# Altium schematic sheet PowerSupplies.SchDoc: =ProjectName
size 420 x 297 mm; Author: G.K.; CompanyName: WUT; DrawnBy: P.K.; Organization: WUT ISE; Address1: Warsaw Univeristy of Technology; Address2: Nowowiejska 15/19; DocumentNumber: 4; Revision: 1.0; SheetNumber: 4; SheetTotal: 12; EDA_Number: ARTIQ; Projet: ARTIQ/SINARA; ModifiedBy: -; CreateDate: XX/XX/XXXX; CheckedDate: -; Title2: PowerSupplies.SchDoc; DivGrp: ISE; Designer: P.K.; ModifiedDate: -; ProjectName: ARTIQ/SINARA
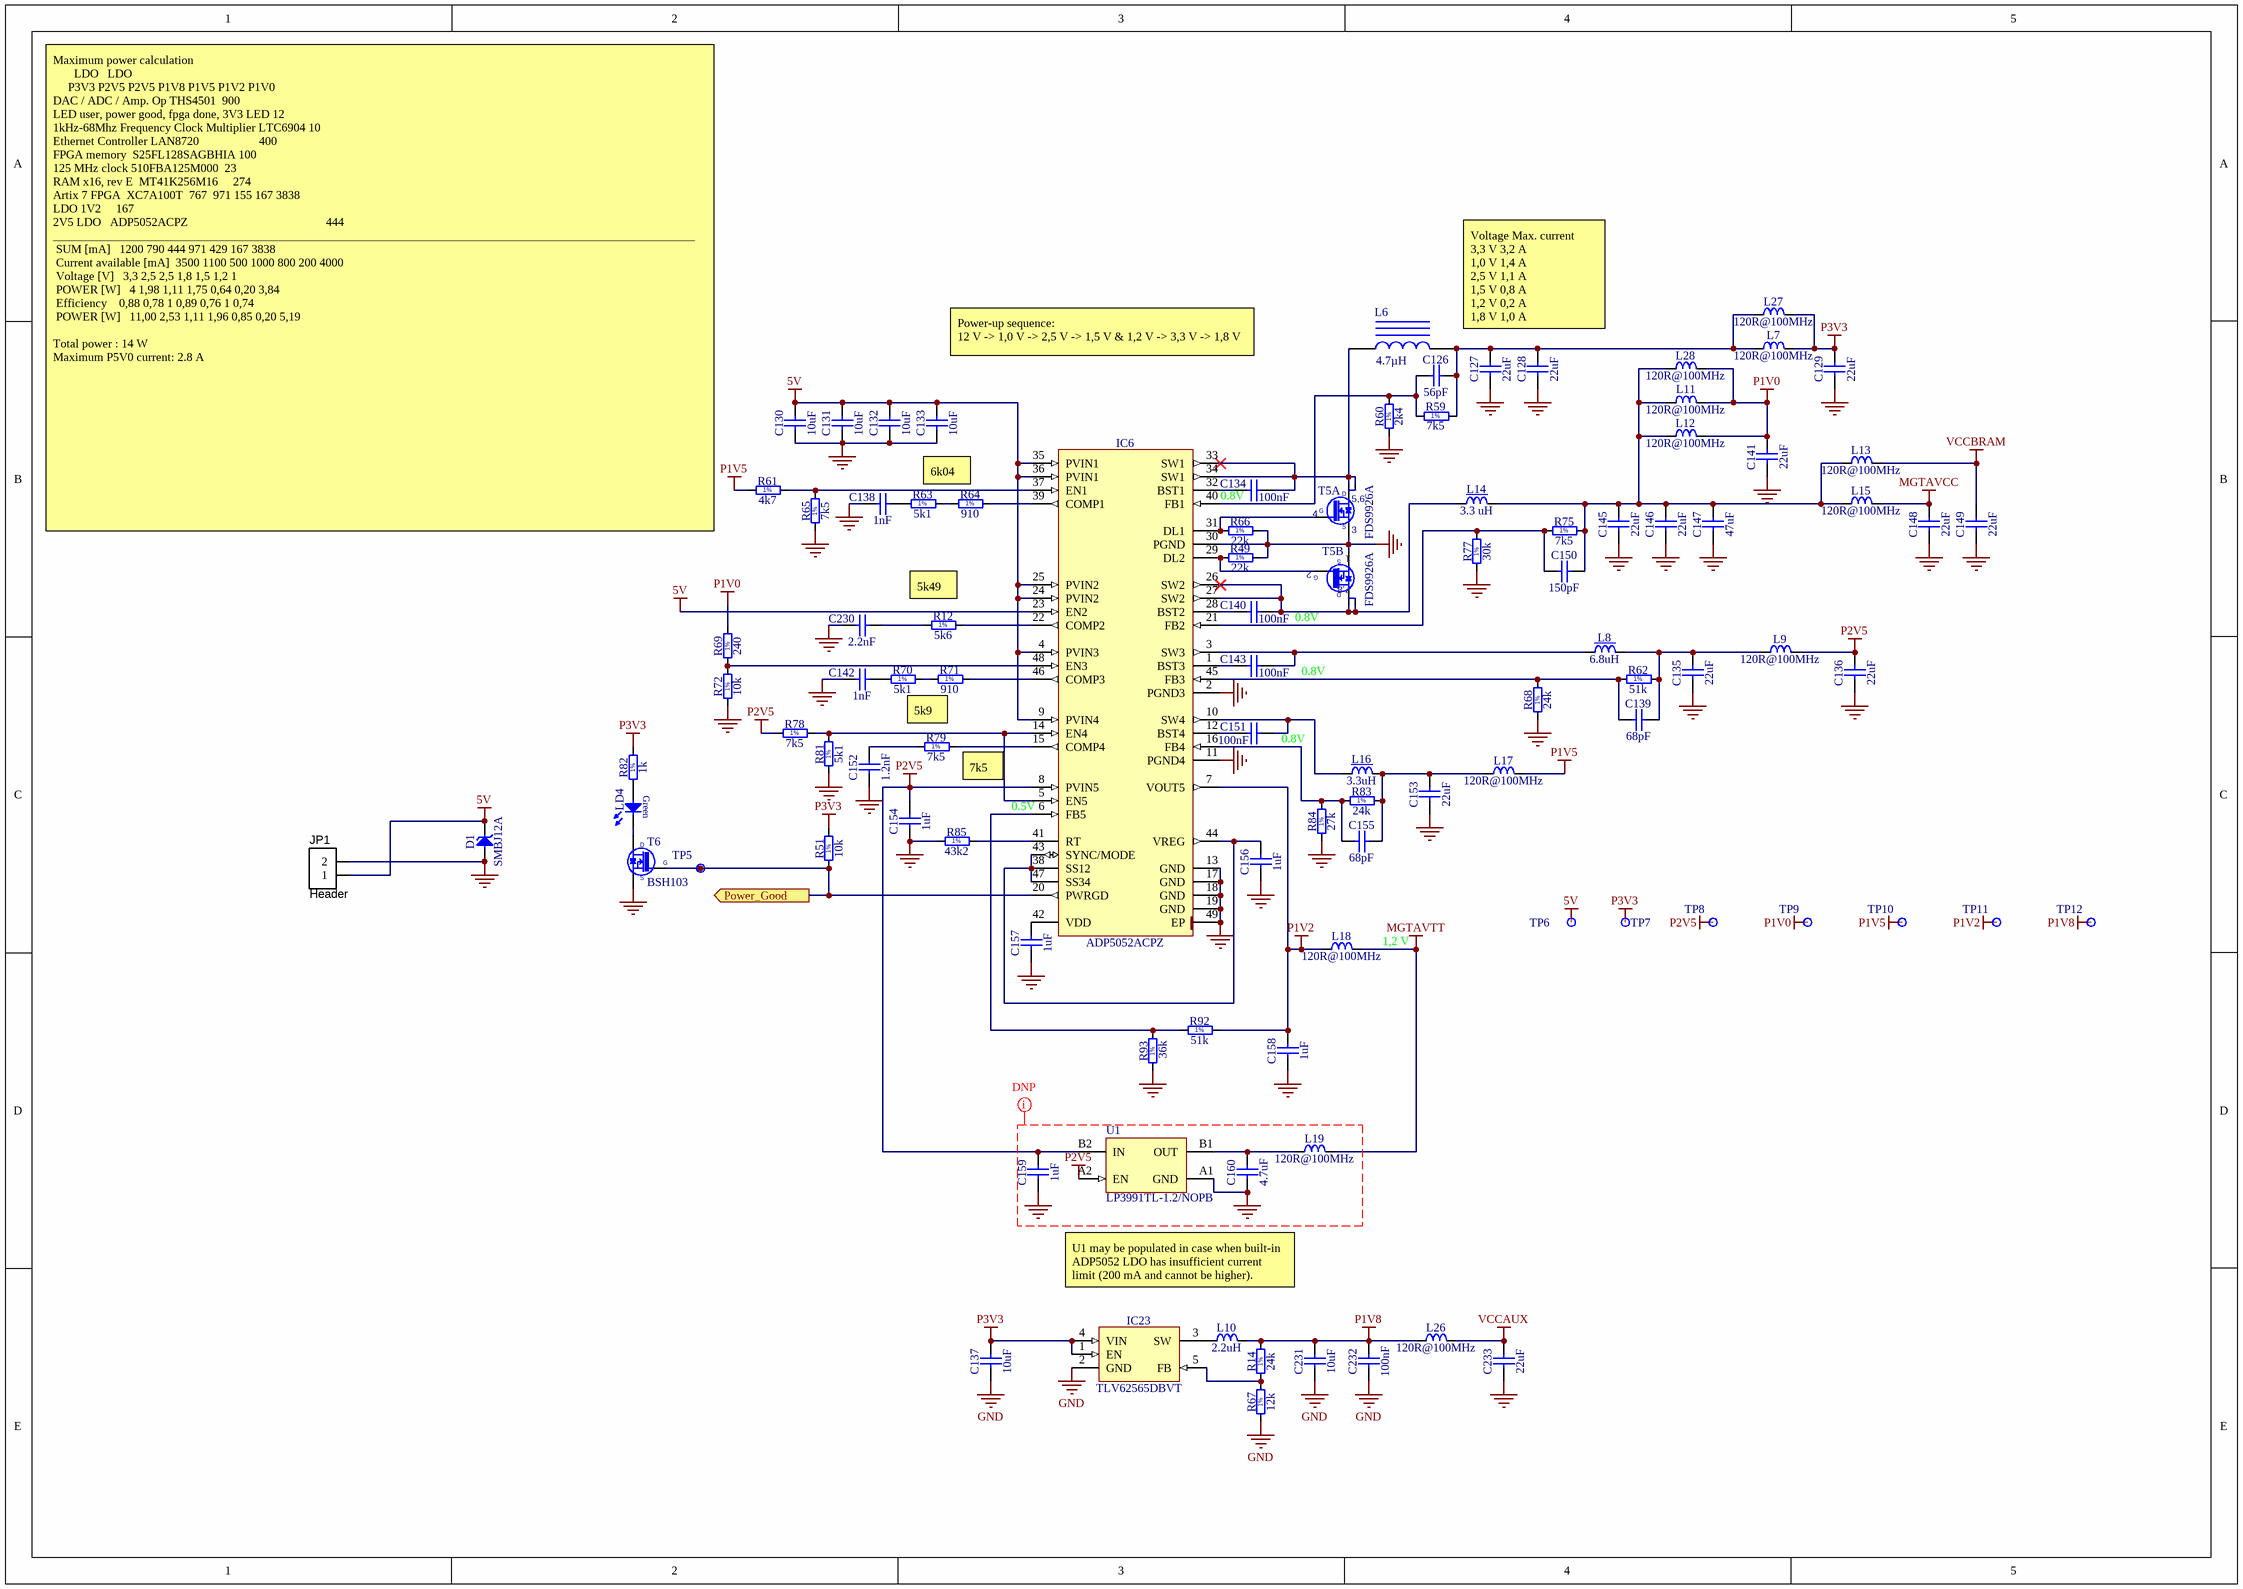
[diagram p0: PowerSupplies.SchDoc]

## Parts
C126  56pF  [CAPC1608X87N]
C127  22uF  [CAPC1709X100N]
C128  22uF  [CAPC1709X100N]
C129  22uF  [CAPC1709X100N]
C130  10uF  [CAPC2012X95N]
C131  10uF  [CAPC2012X95N]
C132  10uF  [CAPC2012X95N]
C133  10uF  [CAPC2012X95N]
C134  100nF  [CAPC0603X33N]
C135  22uF  [CAPC1709X100N]
C136  22uF  [CAPC1709X100N]
C137  10uF  [CAPC2012X95N]
C138  1nF  [CAPC1005X55N]
C139  68pF  [CAPC1005X55N]
C140  100nF  [CAPC0603X33N]
C141  22uF  [CAPC1709X100N]
C142  1nF  [CAPC1005X55N]
C143  100nF  [CAPC0603X33N]
C145  22uF  [CAPC1709X100N]
C146  22uF  [CAPC1709X100N]
C147  47uF  [CAPC3225X270N]
C148  22uF  [CAPC1709X100N]
C149  22uF  [CAPC1709X100N]
C150  150pF  [CAPC1005X55N]
C151  100nF  [CAPC0603X33N]
C152  1.2nF  [CAPC1608X87N]
C153  22uF  [CAPC1709X100N]
C154  1uF  [CAPC1005X55N]
C155  68pF  [CAPC1005X55N]
C156  1uF  [CAPC1005X55N]
C157  1uF  [CAPC1005X55N]
C158  1uF  [CAPC1005X55N]
C159  1uF  [CAPC1005X55N]
C160  4.7uF  [CAPC2012X135N]
C230  2.2nF  [CAPC1005X55N]
C231  10uF  [CAPC2012X95N]
C232  100nF  [CAPC0603X33N]
C233  22uF  [CAPC1709X100N]
D1  SMBJ12A  [SMB]
IC6  ADP5052ACPZ  [QFN50P700X700X80-49N-S570]
IC23  TLV62565DBVT  [SOT95P280X145-5N]
JP1  Header  [HDR_1x2_Offset]  (no BOM)
L6  Inductance: 4.7µH  [COBU-DR74-4R7-R_V]  (hidden comment: DR74-4R7-R)
L7  120R@100MHz  [INDC1608X65N]
L8  6.8uH  [IND_COILCRAFT_XAL4030]
L9  120R@100MHz  [INDC1608X65N]
L10  2.2uH  [IND_WURTH_WE-PMCI_0806LR]
L11  120R@100MHz  [INDC1608X65N]
L12  120R@100MHz  [INDC1608X65N]
L13  120R@100MHz  [INDC1608X65N]
L14  3.3 uH  [IHLP-2020BZ-11]
L15  120R@100MHz  [INDC1608X65N]
L16  3.3uH  [IND_WURTH_WE-PD3_S]
L17  120R@100MHz  [INDC1608X65N]
L18  120R@100MHz  [INDC1608X65N]
L19  120R@100MHz  [INDC1608X65N]
L26  120R@100MHz  [INDC1608X65N]
L27  120R@100MHz  [INDC1608X65N]
L28  120R@100MHz  [INDC1608X65N]
LD4  (no value)  [LED_KINGBRIGHT_KPH-1608CGCK]
R12  5k6  [RESC1005X40N]
R14  24k  [RESC1005X40N]
R49  22k  [RESC1005X40N]
R51  10k  [RESC1005X40N]
R59  7k5  [RESC1005X40N]
R60  2k4  [RESC1005X40N]
R61  4k7  [RESC1005X40N]
R62  51k  [RESC1005X40N]
R63  5k1  [RESC1005X40N]
R64  910  [RESC1005X40N]
R65  7k5  [RESC1005X40N]
R66  22k  [RESC1005X40N]
R67  12k  [RESC1005X40N]
R68  24k  [RESC1005X40N]
R69  240  [RESC1005X40N]
R70  5k1  [RESC1005X40N]
R71  910  [RESC1005X40N]
R72  10k  [RESC1005X40N]
R75  7k5  [RESC1005X40N]
R77  30k  [RESC1005X40N]
R78  7k5  [RESC1005X40N]
R79  7k5  [RESC1005X40N]
R81  5k1  [RESC1005X40N]
R82  1k  [RESC1005X40N]
R83  24k  [RESC1005X40N]
R84  27k  [RESC1005X40N]
R85  43k2  [RESC1005X35N]
R92  51k  [RESC1005X40N]
R93  36k  [RESC1005X40N]
T5  FDS9926A  [SOIC127P600X175-8N]  (parts A,B of 2)
T6  BSH103  [SOT23-3N]
TP5  Power Good  [TPS127]  (value not drawn)
TP6  P12V0  [TPS127]  (value not drawn)
TP7  P3V3  [TPS127]  (value not drawn)
TP8  P2V5  [TPS127]  (value not drawn)
TP9  P1V0  [TPS127]  (value not drawn)
TP10  P1V5  [TPS127]  (value not drawn)
TP11  P1V2  [TPS127]  (value not drawn)
TP12  P1V8  [TPS127]  (value not drawn)
U1  LP3991TL-1.2/NOPB  [YZR0004ABBA]

## Ports
Power_Good (out)

## Nets
5V: C130.2 C131.2 C132.2 C133.2 D1.1(C) IC6.4(PVIN3) IC6.9(PVIN4) IC6.23(EN2) IC6.24(PVIN2) IC6.25(PVIN2) IC6.35(PVIN1) IC6.36(PVIN1) JP1.1 TP6.1
GND: C127.1 C128.1 C129.1 C130.1 C131.1 C132.1 C133.1 C135.1 C136.1 C137.1 C138.1 C141.1 C142.1 C145.1 C146.1 C147.1 C148.1 C149.1 C152.1 C153.1 C154.1 C156.1 C157.1 C158.1 C159.1 C160.1 C230.1 C231.1 C232.1 C233.1 D1.2(A) IC6.2(PGND3) IC6.11(PGND4) IC6.13(GND) IC6.17(GND) IC6.18(GND) IC6.19(GND) IC6.30(PGND) IC6.49(EP) IC23.2(GND) JP1.2 R49.2 R60.1 R65.1 R66.2 R67.1 R68.1 R72.1 R77.1 R81.1 R84.1 R85.1 R93.1 T5.1(S) T5.3(S) T6.2(S) U1.A1(GND)
MGTAVCC: C148.2 L15.2
MGTAVTT: L18.2 L19.2
P1V0: C141.2 L11.2 L12.2 L28.2 R69.2 TP9.1
P1V2: C158.2 IC6.7(VOUT5) L18.1 R92.2 TP11.1
P1V5: L17.2 R61.1 TP10.1
P1V8: C231.2 C232.2 L10.2 L26.1 R14.2 TP12.1
P2V5: C136.2 C154.2 C159.2 IC6.8(PVIN5) L9.2 R78.1 TP8.1 U1.A2(EN) U1.B2(IN)
P3V3: C129.2 C137.2 IC23.1(EN) IC23.4(VIN) L7.2 L27.2 R51.2 R82.2 TP7.1
VCCAUX: C233.2 L26.2
VCCBRAM: C149.2 L13.2
Power_Good: IC6.20(PWRGD) R51.1 T6.1(G) TP5.1 ; port Power_Good
NetC126_1: C126.1 IC6.40(FB1) R59.1 R60.2
NetC126_2: C126.2 C127.2 C128.2 L6.2 L7.1 L27.1 R59.2
NetC134_1: C134.1 IC6.33(SW1) IC6.34(SW1) L6.1 T5.5(D) T5.6(D)
NetC134_2: C134.2 IC6.32(BST1)
NetC135_2: C135.2 C139.2 L8.2 L9.1 R62.2
NetC138_2: C138.2 R63.1
NetC139_1: C139.1 IC6.45(FB3) R62.1 R68.2
NetC140_1: C140.1 IC6.26(SW2) IC6.27(SW2) L14.1 T5.7(D) T5.8(D)
NetC140_2: C140.2 IC6.28(BST2)
NetC142_2: C142.2 R70.1
NetC143_1: C143.1 IC6.3(SW3) L8.1
NetC143_2: C143.2 IC6.1(BST3)
NetC145_2: C145.2 C146.2 C147.2 C150.2 L11.1 L12.1 L13.1 L14.2 L15.1 L28.1 R75.2
NetC150_1: C150.1 IC6.21(FB2) R75.1 R77.2
NetC151_1: C151.1 IC6.10(SW4) L16.1
NetC151_2: C151.2 IC6.12(BST4)
NetC152_2: C152.2 R79.1
NetC153_2: C153.2 C155.2 L16.2 L17.1 R83.2
NetC155_1: C155.1 IC6.16(FB4) R83.1 R84.2
NetC156_2: C156.2 IC6.38(SS12) IC6.43(SYNC/MODE) IC6.44(VREG) IC6.47(SS34)
NetC157_2: C157.2 IC6.42(VDD)
NetC160_2: C160.2 L19.1 U1.B1(OUT)
NetC230_2: C230.2 R12.1
NetIC6_5: IC6.5(EN5) IC6.14(EN4) R78.2 R81.2
NetIC6_6: IC6.6(FB5) R92.1 R93.2
NetIC6_15: IC6.15(COMP4) R79.2
NetIC6_22: IC6.22(COMP2) R12.2
NetIC6_29: IC6.29(DL2) R49.1 T5.2(G)
NetIC6_31: IC6.31(DL1) R66.1 T5.4(G)
NetIC6_37: IC6.37(EN1) R61.2 R65.2
NetIC6_39: IC6.39(COMP1) R64.2
NetIC6_41: IC6.41(RT) R85.2
NetIC6_46: IC6.46(COMP3) R71.2
NetIC6_48: IC6.48(EN3) R69.1 R72.2
NetIC23_3: IC23.3(SW) L10.1
NetIC23_5: IC23.5(FB) R14.1 R67.2
NetLD4_1: LD4.1(A) R82.1
NetLD4_2: LD4.2(C) T6.3(D)
NetR63_2: R63.2 R64.1
NetR70_2: R70.2 R71.1

## Layout directives
rule Undefined: GND, P2V5

## Notes on the sheet
- Voltage	Max. current
  3,3 V	3,2 A
  1,0 V	1,4 A
  2,5 V	1,1 A
  1,5 V	0,8 A
  1,2 V	0,2 A
  1,8 V	1,0 A
- Power-up sequence:
  12 V -> 1,0 V -> 2,5 V -> 1,5 V & 1,2 V -> 3,3 V -> 1,8 V
- (near R61) Maximum power calculation
  LDO			LDO
  P3V3	P2V5	P2V5	P1V8	P1V5	P1V2	P1V0
  DAC / ADC / Amp. Op THS4501		900
  LED user, power good, fpga done, 3V3 LED	12
  1kHz-68Mhz Frequency Clock Multiplier LTC6904	10
  Ethernet Controller	LAN8720		                  400
  FPGA memory		S25FL128SAGBHIA	100
  125 MHz clock	510FBA125M000		23
  RAM x16, rev E		MT41K256M16					274
  Artix 7 FPGA		XC7A100T		767		971	155	167	3838
  LDO 1V2					167
  2V5 LDO			ADP5052ACPZ                                              444
  ___________________________________________________________________________________________________________
  SUM [mA]			1200	790	444	971	429	167	3838
  Current available [mA]		3500	1100	500	1000	800	200	4000
  Voltage [V]			3,3	2,5	2,5	1,8	1,5	1,2	1
  POWER [W]			4	1,98	1,11	1,75	0,64	0,20	3,84
  Efficiency				0,88	0,78	1	0,89	0,76	1	0,74
  POWER [W]			11,00	2,53	1,11	1,96	0,85	0,20	5,19
  Total power : 14 W
  Maximum P5V0 current: 2.8 A
- 6k04
- (near C134) 0.8V
- (near R12) 5k49
- (near T5) 0.8V
- 5k9
- (near C143) 0.8V
- (near R79) 7k5
- (near C151) 0.8V
- (near IC6) 0.5V
- (near L18) 1,2 V
- U1 may be populated in case when built-in ADP5052 LDO has insufficient current limit (200 mA and cannot be higher).
- (in symbol 43k2 1% 0402) 1%
- (in symbol FDS9926A, part A) 5,6
- (in symbol FDS9926A, part B) 7,8
- (in symbol KINGBRIGHT_KPTR-3216CGCK) Green
- (in symbol R0402_1k_1%_0.0625W_100PPM) 1%
- (in symbol R0402_2K4_1%_0.0625W_100PPM) 1%
- (in symbol R0402_4K7_1%_0.0625W_100PPM) 1%
- (in symbol R0402_5K1_1%_0.0625W_100PPM) 1%
- (in symbol R0402_5K6_1%_0.0625W_100PPM) 1%
- (in symbol R0402_7K5_1%_0.0625W_100PPM) 1%
- (in symbol R0402_10K_1%_0.0625W_100PPM) 1%
- (in symbol R0402_12K_1%_0.0625W_100PPM) 1%
- (in symbol R0402_22K_1%_0.0625W_100PPM) 1%
- (in symbol R0402_24K_1%_0.0625W_100PPM) 1%
- (in symbol R0402_27K_1%_0.0625W_100PPM) 1%
- (in symbol R0402_30K_1%_0.0625W_100PPM) 1%
- (in symbol R0402_36K_1%_0.0625W_100PPM) 1%
- (in symbol R0402_51K_1%_0.0625W_100PPM) 1%
- (in symbol R0402_240R_1%_0.0625W_100PPM) 1%
- (in symbol R0402_910R_1%_0.0625W_100PPM) 1%

## Library data of the parts
C126 = CC0603_56PF_50V_5%_NP0: Non-polarised capacitor; Part Description: SMD Multilayer Chip Ceramic Capacitor; Manufacturer: GENERIC; Manufacturer1 Part Number: 223886715569; Voltage: 50V; TC: C0G/NP0; Tolerance: ±5%; Part Number: CC0603_56PF_50V_5%_NP0; Component Kind: Standard; Component Type: Standard; Pin Count: 2; Value: 56pF; Status: Preferred; Manufacturer Part Number: CC0603_56PF_50V_5%_NP0; Case: 0603; Mounted: Yes; Socket: No; SMD: Yes; Sense: No; Manufacturer1 Example: PHYCOMP; Manufacturer1 ComponentHeight: 0.87mm; HelpURL: \\cern.ch\dfs\Applications\Altium\Datasheets\CC0603_NP0_PHYCOMP.pdf; Author: CERN DEM JLC; CreateDate: 03.12.2007; LatestRevisionDate: 03.12.2007
C127-C129 C135 C136 C141 C145 C146 C148 C149 C153 C233 = CC0603_22UF_6.3V_20%_X5R: Non-polarised capacitor; Part Description: SMD Multilayer Chip Ceramic Capacitor; Manufacturer: GENERIC; Manufacturer1 Part Number: C1608X5R0J226M080AC; Voltage: 6.3V; TC: X5R; Tolerance: ±20%; Part Number: CC0603_22UF_6.3V_20%_X5R; Component Kind: Standard; Component Type: Standard; Pin Count: 2; Value: 22uF; Status: None; Manufacturer Part Number: CC0603_22UF_6.3V_20%_X5R; Case: 0603; Mounted: Yes; Socket: No; SMD: Yes; Sense: No; Manufacturer1 Example: TDK; Manufacturer1 ComponentHeight: 1mm; HelpURL: \\cern.ch\dfs\Applications\Altium\Datasheets\CC0603_X5R_TDK_C.pdf; Author: CERN DEM JLC; CreateDate: 16.12.2013; LatestRevisionDate: 13.09.2016
C130-C133 C137 C231 = CC0805_10UF_25V_10%_X5R: Non-polarised capacitor; Part Description: SMD Multilayer Chip Ceramic Capacitor; Manufacturer: GENERIC; Manufacturer1 Part Number: GRM219R61E106KA12D; Voltage: 25V; TC: X5R; Tolerance: ±10%; Part Number: CC0805_10UF_25V_10%_X5R; Component Kind: Standard; Component Type: Standard; Pin Count: 2; Value: 10uF; Status: Preferred; Manufacturer Part Number: CC0805_10UF_25V_10%_X5R; Case: 0805; Mounted: Yes; Socket: No; SMD: Yes; Sense: No; Manufacturer1 Example: MURATA; Manufacturer1 ComponentHeight: 0.95mm; HelpURL: \\cern.ch\dfs\Applications\Altium\Datasheets\CC0805_X5R_MURATA_GRM.pdf; Author: CERN DEM JLC
  C130-C133: CreateDate: 2012-10-25; LatestRevisionDate: 2016-09-06
  C137 C231: CreateDate: 25.10.2012; LatestRevisionDate: 06.09.2016
C134 C140 C143 C151 C232 = CC0201_100NF_6.3V_10%_X5R: Non-polarised capacitor; Part Description: SMD Multilayer Chip Ceramic Capacitor; Manufacturer: GENERIC; Manufacturer1 Part Number: 02016D104KAT2A; Voltage: 6.3V; TC: X5R; Tolerance: ±10%; Part Number: CC0201_100NF_6.3V_10%_X5R; Component Kind: Standard; Component Type: Standard; Pin Count: 2; Value: 100nF; Status: Not Recommended; Manufacturer Part Number: CC0201_100NF_6.3V_10%_X5R; Case: 0201; Mounted: Yes; Socket: No; SMD: Yes; Sense: No; Manufacturer1 Example: AVX; Manufacturer1 ComponentHeight: 0.33mm; HelpURL: \\cern.ch\dfs\Applications\Altium\Datasheets\CC0201_X5R_AVX.pdf; Author: CERN DEM JLC
  C134 C140 C143 C151: CreateDate: 2007-12-03; LatestRevisionDate: 2007-12-03
  C232: CreateDate: 03.12.2007; LatestRevisionDate: 03.12.2007
C138 C142 = CC0402_1NF_50V_10%_X7R: Non-polarised capacitor; Part Description: SMD Multilayer Chip Ceramic Capacitor; Manufacturer: GENERIC; Manufacturer1 Part Number: 223858715623; Voltage: 50V; TC: X7R; Tolerance: ±10%; Part Number: CC0402_1NF_50V_10%_X7R; Component Kind: Standard; Component Type: Standard; Pin Count: 2; Value: 1nF; Status: Not Recommended; Manufacturer Part Number: CC0402_1NF_50V_10%_X7R; Case: 0402; Mounted: Yes; Socket: No; SMD: Yes; Sense: No; Manufacturer1 Example: PHYCOMP; Manufacturer1 ComponentHeight: 0.55mm; HelpURL: \\cern.ch\dfs\Applications\Altium\Datasheets\CC0402_X7R_PHYCOMP.pdf; Author: CERN DEM JLC; CreateDate: 03.12.2007; LatestRevisionDate: 03.12.2007
C139 C155 = CC0402_68PF_50V_5%_C0G: Non-polarised capacitor; Part Description: SMD Multilayer Chip Ceramic Capacitor; Manufacturer: GENERIC; Manufacturer1 Part Number: C0402C680J5GACTU; Voltage: 50V; TC: C0G/NP0; Tolerance: ±5%; Part Number: CC0402_68PF_50V_5%_C0G; Component Kind: Standard; Component Type: Standard; Pin Count: 2; Value: 68pF; Status: Preferred; Manufacturer Part Number: CC0402_68PF_50V_5%_C0G; Case: 0402; Mounted: Yes; Socket: No; SMD: Yes; Sense: No; Manufacturer1 Example: KEMET; Manufacturer1 ComponentHeight: 0.55mm; HelpURL: \\cern.ch\dfs\Applications\Altium\Datasheets\CC0805_C0G_KEMET_(Commercial Grade).pdf; Author: CERN DEM JLC; CreateDate: 03.12.2007; LatestRevisionDate: 22.04.2015
C147 = CC1210_47UF_10V_10%_X7R: Non-polarised capacitor; Part Description: SMD Multilayer Chip Ceramic Capacitor; Manufacturer: GENERIC; Manufacturer1 Part Number: GRM32ER71A476KE15; Voltage: 10V; TC: X7R; Tolerance: ±10%; Part Number: CC1210_47UF_10V_10%_X7R; Component Kind: Standard; Component Type: Standard; Pin Count: 2; Value: 47uF; Status: None; Manufacturer Part Number: CC1210_47UF_10V_10%_X7R; Case: 1210; Mounted: Yes; Socket: No; SMD: Yes; Sense: No; Manufacturer1 Example: MURATA; Manufacturer1 ComponentHeight: 2.7mm; HelpURL: \\cern.ch\dfs\Applications\Altium\Datasheets\CC1210_X7R_MURATA.pdf; Author: CERN DEM BC; CreateDate: 18.11.2015; LatestRevisionDate: 18.11.2015
C150 = CC0402_150PF_50V_5%_C0G: Non-polarised capacitor; Part Description: SMD Multilayer Chip Ceramic Capacitor; Manufacturer: GENERIC; Manufacturer1 Part Number: C0402C151J5GACTU; Voltage: 50V; TC: C0G/NP0; Tolerance: ±5%; Part Number: CC0402_150PF_50V_5%_C0G; Component Kind: Standard; Component Type: Standard; Pin Count: 2; Value: 150pF; Status: Preferred; Manufacturer Part Number: CC0402_150PF_50V_5%_C0G; Case: 0402; Mounted: Yes; Socket: No; SMD: Yes; Sense: No; Manufacturer1 Example: KEMET; Manufacturer1 ComponentHeight: 0.55mm; HelpURL: \\cern.ch\dfs\Applications\Altium\Datasheets\CC0805_C0G_KEMET_(Commercial Grade).pdf; Author: CERN DEM JLC; CreateDate: 03.12.2007; LatestRevisionDate: 22.04.2015
C152 = CC0603_1.2NF_50V_10%_X7R: Non-polarised capacitor; Part Description: SMD Multilayer Chip Ceramic Capacitor; Manufacturer: GENERIC; Manufacturer1 Part Number: 223858615624; Voltage: 50V; TC: X7R; Tolerance: ±10%; Part Number: CC0603_1.2NF_50V_10%_X7R; Component Kind: Standard; Component Type: Standard; Pin Count: 2; Value: 1.2nF; Status: Preferred; Manufacturer Part Number: CC0603_1.2NF_50V_10%_X7R; Case: 0603; Mounted: Yes; Socket: No; SMD: Yes; Sense: No; Manufacturer1 Example: PHYCOMP; Manufacturer1 ComponentHeight: 0.87mm; HelpURL: \\cern.ch\dfs\Applications\Altium\Datasheets\CC0603_X7R_PHYCOMP.pdf; Author: CERN DEM JLC; CreateDate: 03.12.2007; LatestRevisionDate: 03.12.2007
C154 C156-C159 = CC0402_1UF_16V_10%_X5R: Non-polarised capacitor; Part Description: SMD Multilayer Chip Ceramic Capacitor; Manufacturer: GENERIC; Manufacturer1 Part Number: C1005X5R1C105KT; Voltage: 16V; TC: X5R; Tolerance: ±10%; Part Number: CC0402_1UF_16V_10%_X5R; Component Kind: Standard; Component Type: Standard; Pin Count: 2; Value: 1uF; Status: Preferred; Manufacturer Part Number: CC0402_1UF_16V_10%_X5R; Case: 0402; Mounted: Yes; Socket: No; SMD: Yes; Sense: No; Manufacturer1 Example: TDK; Manufacturer1 ComponentHeight: 0.55mm; HelpURL: \\cern.ch\dfs\Applications\Altium\Datasheets\CC0402_X5R_TDK_C.pdf; Author: CERN DEM JLC; CreateDate: 2012-10-25; LatestRevisionDate: 2012-10-25
C160 = CC0805_4.7UF_10V_10%_X5R: Non-polarised capacitor; Part Description: SMD Multilayer Chip Ceramic Capacitor; Manufacturer: GENERIC; Manufacturer1 Part Number: 222224013672; Voltage: 10V; TC: X5R; Tolerance: ±10%; Part Number: CC0805_4.7UF_10V_10%_X5R; Component Kind: Standard; Component Type: Standard; Pin Count: 2; Value: 4.7uF; Status: Preferred; Manufacturer Part Number: CC0805_4.7UF_10V_10%_X5R; Case: 0805; Mounted: Yes; Socket: No; SMD: Yes; Sense: No; Manufacturer1 Example: PHYCOMP; Manufacturer1 ComponentHeight: 1.45mm; HelpURL: \\cern.ch\dfs\Applications\Altium\Datasheets\CC0805_X5R_PHYCOMP_HC.pdf; Author: CERN DEM JLC; CreateDate: 03.12.2007; LatestRevisionDate: 03.12.2007
C230 = CC0402_2.2NF_50V_10%_X7R: Non-polarised capacitor; Part Description: SMD Multilayer Chip Ceramic Capacitor; Manufacturer: GENERIC; Manufacturer1 Part Number: 223858715627; Voltage: 50V; TC: X7R; Tolerance: ±10%; Part Number: CC0402_2.2NF_50V_10%_X7R; Component Kind: Standard; Component Type: Standard; Pin Count: 2; Value: 2.2nF; Status: Not Recommended; Manufacturer Part Number: CC0402_2.2NF_50V_10%_X7R; Case: 0402; Mounted: Yes; Socket: No; SMD: Yes; Sense: No; Manufacturer1 Example: PHYCOMP; Manufacturer1 ComponentHeight: 0.55mm; HelpURL: \\cern.ch\dfs\Applications\Altium\Datasheets\CC0402_X7R_PHYCOMP.pdf; Author: CERN DEM JLC; CreateDate: 03.12.2007; LatestRevisionDate: 03.12.2007
D1 = SMBJ12A: Zener Diode; Part Description: Uni-Directional Transient Voltage Suppressor Diode; Manufacturer: FAIRCHILD SEMICONDUCTOR; Voltage: 12V; Power: 600W; PressFit: No; Bonding: No; Part Number: SMBJ12A; Component Kind: Standard; Component Type: Standard; Device: SMBJ12A; Footprint: DIOM5336X265N; PackageDescription: DO-214-AA/SMB Diode, Molded Body; 5.34mm L X 3.625mm W X 2.65mm H, IPC Medium Density; Manufacturer Part Number: SMBJ12A; Pin Count: 2; Case: DO-214AA; Mounted: Yes; Socket: No; SMD: Yes; Sense: No; ComponentHeight: 2.65mm; HelpURL: \\cern.ch\dfs\Applications\Altium\Datasheets\SMBJ.pdf; Author: CERN DEM JLC; CreateDate: 10.04.2013; LatestRevisionDate: 10.04.2013
IC6 = ADP5052ACPZ: 5-Channel Integrated Power Solution with Quad buck Regulators and 200mA LDO Regulator; Manufacturer: ANALOG DEVICES; PressFit: No; Bonding: No; Part Number: ADP5052ACPZ; Component Kind: Standard; Component Type: Standard; Device: ADP5052ACPZ; PackageDescription: QFN, 0.50mm pitch,square; 12 pin X 12 pin, 7mm X 7mm X 0.8mm H body (w/thermal tab 5.70 X 5.70mm),  IPC Medium Density; Part Description: 5-Channel Integrated Power Solution with Quad buck Regulators and 200mA LDO Regulator; Manufacturer Part Number: ADP5052ACPZ; Pin Count: 49; Case: QFN48; Mounted: Yes; Socket: No; SMD: Yes; Sense: No; ComponentHeight: 0.8mm; HelpURL: \\cern.ch\dfs\Applications\Altium\Datasheets\ADP5052ACPZ.pdf; Author: CERN DEM BC; CreateDate: 2015-07-30; LatestRevisionDate: 2015-07-30
IC23 = TLV62565DBVT: 1.5A High Efficiency Step-Down Converter, Adjustable Output Voltage; Manufacturer: TEXAS INSTRUMENTS; PressFit: No; Bonding: No; Part Number: TLV62565DBVT; Component Kind: Standard; Component Type: Standard; Device: TLV62565DBVT; PackageDescription: SOT, 0.95mm Pitch; 5 Pin, 1.60mm W X 2.90mm L X 1.45mm H Body, IPC Medium Density; Part Description: 1.5A High Efficiency Step-Down Converter, Adjustable Output Voltage; Manufacturer Part Number: TLV62565DBVT; Pin Count: 5; Case: SOT23-5; Mounted: Yes; Socket: No; SMD: Yes; Sense: No; ComponentHeight: 1.45mm; HelpURL: \\cern.ch\dfs\Applications\Altium\Datasheets\TLV62565DBVT.pdf; Author: CERN DEM JMW; CreateDate: 29.08.2016; LatestRevisionDate: 29.08.2016
JP1 = Header2P: 12V  G
L6 = CMP-2000-06180-1: High Power Density, High Efficiency, Shielded Inductor, 4.7 uH, -40 to 125 degC, RoHS, Tape and Reel; Manufacturer: Eaton; Tolerance: ±20%; Current - Saturation: 4.37A; Type: Wirewound; Frequency - Test: 100kHz; Current Rating: 3.34A; DC Resistance (DCR): 25.4mOhm; Material - Core: Ferrite; Package Reference: DR74-4R7-R; Ratings: -; Frequency - Self Resonant: -; Operating Temperature: -40°C~125°C; Family: FixedInductors; Package / Case: Nonstandard; Mounting Type: SurfaceMount; Series: DR; Q @ Freq: -; Datasheet Version: 12/2012; Package Description: 2-Pin Surface Mount Device, Body 7.6 x 7.6 mm; Height - Seated (Max): 0.171"(4.35mm); Datasheet URL: https://datasheet.ciiva.com/14667/0900766b8116a153-14667792.pdf; Packaging: Tape&amp;Reel(TR); Manufacturer URL: http://www.cooperindustries.com/content/public/en/bussmann/electronics.html; Mounting Technology: SurfaceMount; Size / Dimension: 0.299"Lx0.299"W(7.60mmx7.60mm); Category: Inductors,Coils,Chokes; Shielding: Shielded
L7 L9 L11-L13 L15 L17-L19 L26-L28 = IND0603_MURATA_BLM18SG121TN1D: Inductor; Part Description: SMD EMIFIL Suppression Chip Ferrite Bead; Manufacturer: MURATA; Power: 3A; Resistance: 0.025R; Tolerance: ±25%; Part Number: IND0603_MURATA_BLM18SG121TN1D; Component Kind: Standard; Component Type: Standard; Pin Count: 2; Value: 120R@100MHz; Status: None; Manufacturer Part Number: BLM18SG121TN1D; Case: 0603; Mounted: Yes; Socket: No; SMD: Yes; Sense: No; ComponentHeight: 0.65mm; HelpURL: \\cern.ch\dfs\Applications\Altium\Datasheets\IND0603_MURATA_BLM18S.pdf; Author: CERN DEM JLC; CreateDate: 23.07.2014; LatestRevisionDate: 23.07.2014
L8 = IND_6.8UH_20%_COILCRAFT_XAL4030: Inductor With Core; Part Description: SMD Shielded Power Inductor; Manufacturer Part Number: XAL4030-682MEB; Power: 3A; Resistance: 0.0741R; Tolerance: ±20%; Part Number: IND_6.8UH_20%_COILCRAFT_XAL4030; Component Kind: Standard; Component Type: Standard; Pin Count: 2; Value: 6.8uH; Status: None; Manufacturer: COILCRAFT; Mounted: Yes; Socket: No; SMD: Yes; Sense: No; ComponentHeight: 2.1mm; HelpURL: \\cern.ch\dfs\Applications\Altium\Datasheets\IND_COILCRAFT_XAL4030.pdf; Author: CERN DEM MR; CreateDate: 14.03.2016; LatestRevisionDate: 14.03.2016
L10 = IND_2.2UH_20%_WURTH_WE-PMCI_74479276222C: Inductor; Part Description: SMD Power Molded Chip  Inductor (WE-PMCI Series); Manufacturer: WURTH ELEKTRONIK; Power: 1.1A; Resistance: 0.112R; Tolerance: ±20%; Part Number: IND_2.2UH_20%_WURTH_WE-PMCI_74479276222C; Component Kind: Standard; Component Type: Standard; Pin Count: 2; Value: 2.2uH; Status: None; Manufacturer Part Number: 74479276222C; Case: 0806; Mounted: Yes; Socket: No; SMD: Yes; Sense: No; ComponentHeight: 1mm; HelpURL: \\cern.ch\dfs\Applications\Altium\Datasheets\IND_WURTH_WE-PMCI_74479276222C.pdf; Author: CERN DEM JLC; CreateDate: 20.10.2016; LatestRevisionDate: 20.10.2016
L14 = IHLP2020BZER3R3M11: Inductor With Core; Manufacturer: Vishay; Power: 4.1 A; Series Resistance: 57.8 mOhm; Tolerance: 20%; Value: 3.3 uH; HelpURL: http://datasheet.octopart.com/IHLP2020BZER3R3M11-Vishay-datasheet-68298978.pdf; Part Number: IHLP2020BZER3R3M11; Supplier 1: Farnell
L16 = IND_3.3UH_20%_WURTH_WE-PD3_74451033: Inductor With Core; Part Description: Shielded Power Inductor (WE-PD 3 Series); Manufacturer: WURTH ELEKTRONIK; Power: 1.6A; Resistance: 0.025R; Tolerance: ±20%; Part Number: IND_3.3UH_20%_WURTH_WE-PD3_74451033; Component Kind: Standard; Component Type: Standard; Pin Count: 2; Value: 3.3uH; Status: None; Manufacturer Part Number: 74451033; Mounted: Yes; Socket: No; SMD: Yes; Sense: No; ComponentHeight: 2.92mm; HelpURL: \\cern.ch\dfs\Applications\Altium\Datasheets\IND_WURTH_WE-PD3_74451033.pdf; Author: CERN DEM JLC; CreateDate: 11.05.2010; LatestRevisionDate: 15.09.2014
LD4 = KINGBRIGHT_KPTR-3216CGCK: LED Green 1A 2C; Manufacturer Part Number: KPH-1608CGCK; ComponentHeight: 0.65mm; HelpURL: http://datasheet.octopart.com/KPH-1608CGCK-Kingbright-datasheet-62316526.pdf; Package Description: SMT Green LED, Case 0603, Body L 1.6 x W 0.8mm H 0.65mm
R12 = R0402_5K6_1%_0.0625W_100PPM: Resistor - 1%; Part Description: General Purpose Thick Film Chip Resistor; Manufacturer: GENERIC; Manufacturer1 Part Number: 232270675602L; TC: ±100ppm/°C; PressFit: No; Part Number: R0402_5K6_1%_0.0625W_100PPM; Component Kind: Standard; Component Type: Standard; Pin Count: 2; Value: 5k6; Status: Not Recommended; Power: 0.0625W; Tolerance: ±1%; Manufacturer Part Number: R0402_5K6_1%_0.0625W_100PPM; Case: 0402; Mounted: Yes; Sense: No; Socket: No; SMD: Yes; Manufacturer1 Example: YAGEO PHYCOMP; Manufacturer1 ComponentHeight: 0.4mm; HelpURL: \\cern.ch\dfs\Applications\Altium\Datasheets\R0402_Phycomp_RC0402.pdf; Author: CERN DEM JLC; CreateDate: 03.12.2007; LatestRevisionDate: 17.10.2012
R14 R68 R83 = R0402_24K_1%_0.0625W_100PPM: Resistor - 1%; Part Description: General Purpose Thick Film Chip Resistor; Manufacturer: GENERIC; Manufacturer1 Part Number: 232270672403L; TC: ±100ppm/°C; PressFit: No; Part Number: R0402_24K_1%_0.0625W_100PPM; Component Kind: Standard; Component Type: Standard; Pin Count: 2; Value: 24k; Status: Not Recommended; Power: 0.0625W; Tolerance: ±1%; Manufacturer Part Number: R0402_24K_1%_0.0625W_100PPM; Case: 0402; Mounted: Yes; Sense: No; Socket: No; SMD: Yes; Manufacturer1 Example: YAGEO PHYCOMP; Manufacturer1 ComponentHeight: 0.4mm; HelpURL: \\cern.ch\dfs\Applications\Altium\Datasheets\R0402_Phycomp_RC0402.pdf; Author: CERN DEM JLC; CreateDate: 03.12.2007; LatestRevisionDate: 17.10.2012
R49 R66 = R0402_22K_1%_0.0625W_100PPM: Resistor - 1%; Part Description: General Purpose Thick Film Chip Resistor; Manufacturer: GENERIC; Manufacturer1 Part Number: 232270672203L; TC: ±100ppm/°C; PressFit: No; Part Number: R0402_22K_1%_0.0625W_100PPM; Component Kind: Standard; Component Type: Standard; Pin Count: 2; Value: 22k; Status: Not Recommended; Power: 0.0625W; Tolerance: ±1%; Manufacturer Part Number: R0402_22K_1%_0.0625W_100PPM; Case: 0402; Mounted: Yes; Sense: No; Socket: No; SMD: Yes; Manufacturer1 Example: YAGEO PHYCOMP; Manufacturer1 ComponentHeight: 0.4mm; HelpURL: \\cern.ch\dfs\Applications\Altium\Datasheets\R0402_Phycomp_RC0402.pdf; Author: CERN DEM JLC; CreateDate: 03.12.2007; LatestRevisionDate: 17.10.2012
R51 R72 = R0402_10K_1%_0.0625W_100PPM: Resistor - 1%; Part Description: General Purpose Thick Film Chip Resistor; Manufacturer: GENERIC; Manufacturer1 Part Number: 232270671003L; TC: ±100ppm/°C; PressFit: No; Part Number: R0402_10K_1%_0.0625W_100PPM; Component Kind: Standard; Component Type: Standard; Pin Count: 2; Value: 10k; Status: Not Recommended; Power: 0.0625W; Tolerance: ±1%; Manufacturer Part Number: R0402_10K_1%_0.0625W_100PPM; Case: 0402; Mounted: Yes; Sense: No; Socket: No; SMD: Yes; Manufacturer1 Example: YAGEO PHYCOMP; Manufacturer1 ComponentHeight: 0.4mm; HelpURL: \\cern.ch\dfs\Applications\Altium\Datasheets\R0402_Phycomp_RC0402.pdf; Author: CERN DEM JLC; CreateDate: 03.12.2007; LatestRevisionDate: 17.10.2012
R59 R65 R75 R78 R79 = R0402_7K5_1%_0.0625W_100PPM: Resistor - 1%; Part Description: General Purpose Thick Film Chip Resistor; Manufacturer: GENERIC; Manufacturer1 Part Number: 232270677502L; TC: ±100ppm/°C; PressFit: No; Part Number: R0402_7K5_1%_0.0625W_100PPM; Component Kind: Standard; Component Type: Standard; Pin Count: 2; Value: 7k5; Status: Not Recommended; Power: 0.0625W; Tolerance: ±1%; Manufacturer Part Number: R0402_7K5_1%_0.0625W_100PPM; Case: 0402; Mounted: Yes; Sense: No; Socket: No; SMD: Yes; Manufacturer1 Example: YAGEO PHYCOMP; Manufacturer1 ComponentHeight: 0.4mm; HelpURL: \\cern.ch\dfs\Applications\Altium\Datasheets\R0402_Phycomp_RC0402.pdf; Author: CERN DEM JLC; CreateDate: 03.12.2007; LatestRevisionDate: 17.10.2012
R60 = R0402_2K4_1%_0.0625W_100PPM: Resistor - 1%; Part Description: General Purpose Thick Film Chip Resistor; Manufacturer: GENERIC; Manufacturer1 Part Number: 232270672402L; TC: ±100ppm/°C; PressFit: No; Part Number: R0402_2K4_1%_0.0625W_100PPM; Component Kind: Standard; Component Type: Standard; Pin Count: 2; Value: 2k4; Status: Not Recommended; Power: 0.0625W; Tolerance: ±1%; Manufacturer Part Number: R0402_2K4_1%_0.0625W_100PPM; Case: 0402; Mounted: Yes; Sense: No; Socket: No; SMD: Yes; Manufacturer1 Example: YAGEO PHYCOMP; Manufacturer1 ComponentHeight: 0.4mm; HelpURL: \\cern.ch\dfs\Applications\Altium\Datasheets\R0402_Phycomp_RC0402.pdf; Author: CERN DEM JLC; CreateDate: 03.12.2007; LatestRevisionDate: 17.10.2012
R61 = R0402_4K7_1%_0.0625W_100PPM: Resistor - 1%; Part Description: General Purpose Thick Film Chip Resistor; Manufacturer: GENERIC; Manufacturer1 Part Number: 232270674702L; TC: ±100ppm/°C; PressFit: No; Part Number: R0402_4K7_1%_0.0625W_100PPM; Component Kind: Standard; Component Type: Standard; Pin Count: 2; Value: 4k7; Status: Not Recommended; Power: 0.0625W; Tolerance: ±1%; Manufacturer Part Number: R0402_4K7_1%_0.0625W_100PPM; Case: 0402; Mounted: Yes; Sense: No; Socket: No; SMD: Yes; Manufacturer1 Example: YAGEO PHYCOMP; Manufacturer1 ComponentHeight: 0.4mm; HelpURL: \\cern.ch\dfs\Applications\Altium\Datasheets\R0402_Phycomp_RC0402.pdf; Author: CERN DEM JLC; CreateDate: 03.12.2007; LatestRevisionDate: 17.10.2012
R62 R92 = R0402_51K_1%_0.0625W_100PPM: Resistor - 1%; Part Description: General Purpose Thick Film Chip Resistor; Manufacturer: GENERIC; Manufacturer1 Part Number: 232270674703L; TC: ±100ppm/°C; PressFit: No; Part Number: R0402_51K_1%_0.0625W_100PPM; Component Kind: Standard; Component Type: Standard; Pin Count: 2; Value: 51k; Status: Not Recommended; Power: 0.0625W; Tolerance: ±1%; Manufacturer Part Number: R0402_51K_1%_0.0625W_100PPM; Case: 0402; Mounted: Yes; Sense: No; Socket: No; SMD: Yes; Manufacturer1 Example: YAGEO PHYCOMP; Manufacturer1 ComponentHeight: 0.4mm; HelpURL: \\cern.ch\dfs\Applications\Altium\Datasheets\R0402_Phycomp_RC0402.pdf; Author: CERN DEM JLC; CreateDate: 03.12.2007; LatestRevisionDate: 17.10.2012
R63 R70 R81 = R0402_5K1_1%_0.0625W_100PPM: Resistor - 1%; Part Description: General Purpose Thick Film Chip Resistor; Manufacturer: GENERIC; Manufacturer1 Part Number: 232270675102L; TC: ±100ppm/°C; PressFit: No; Part Number: R0402_5K1_1%_0.0625W_100PPM; Component Kind: Standard; Component Type: Standard; Pin Count: 2; Value: 5k1; Status: Not Recommended; Power: 0.0625W; Tolerance: ±1%; Manufacturer Part Number: R0402_5K1_1%_0.0625W_100PPM; Case: 0402; Mounted: Yes; Sense: No; Socket: No; SMD: Yes; Manufacturer1 Example: YAGEO PHYCOMP; Manufacturer1 ComponentHeight: 0.4mm; HelpURL: \\cern.ch\dfs\Applications\Altium\Datasheets\R0402_Phycomp_RC0402.pdf; Author: CERN DEM JLC; CreateDate: 03.12.2007; LatestRevisionDate: 17.10.2012
R64 R71 = R0402_910R_1%_0.0625W_100PPM: Resistor - 1%; Part Description: General Purpose Thick Film Chip Resistor; Manufacturer: GENERIC; Manufacturer1 Part Number: 232270679101L; TC: ±100ppm/°C; PressFit: No; Part Number: R0402_910R_1%_0.0625W_100PPM; Component Kind: Standard; Component Type: Standard; Pin Count: 2; Value: 910; Status: Not Recommended; Power: 0.0625W; Tolerance: ±1%; Manufacturer Part Number: R0402_910R_1%_0.0625W_100PPM; Case: 0402; Mounted: Yes; Sense: No; Socket: No; SMD: Yes; Manufacturer1 Example: YAGEO PHYCOMP; Manufacturer1 ComponentHeight: 0.4mm; HelpURL: \\cern.ch\dfs\Applications\Altium\Datasheets\R0402_Phycomp_RC0402.pdf; Author: CERN DEM JLC; CreateDate: 03.12.2007; LatestRevisionDate: 17.10.2012
R67 = R0402_12K_1%_0.0625W_100PPM: Resistor - 1%; Part Description: General Purpose Thick Film Chip Resistor; Manufacturer: GENERIC; Manufacturer1 Part Number: 232270671203L; TC: ±100ppm/°C; PressFit: No; Part Number: R0402_12K_1%_0.0625W_100PPM; Component Kind: Standard; Component Type: Standard; Pin Count: 2; Value: 12k; Status: Not Recommended; Power: 0.0625W; Tolerance: ±1%; Manufacturer Part Number: R0402_12K_1%_0.0625W_100PPM; Case: 0402; Mounted: Yes; Sense: No; Socket: No; SMD: Yes; Manufacturer1 Example: YAGEO PHYCOMP; Manufacturer1 ComponentHeight: 0.4mm; HelpURL: \\cern.ch\dfs\Applications\Altium\Datasheets\R0402_Phycomp_RC0402.pdf; Author: CERN DEM JLC; CreateDate: 03.12.2007; LatestRevisionDate: 17.10.2012
R69 = R0402_240R_1%_0.0625W_100PPM: Resistor - 1%; Part Description: General Purpose Thick Film Chip Resistor; Manufacturer: GENERIC; Manufacturer1 Part Number: 232270672401L; TC: ±100ppm/°C; PressFit: No; Part Number: R0402_240R_1%_0.0625W_100PPM; Component Kind: Standard; Component Type: Standard; Pin Count: 2; Value: 240; Status: Not Recommended; Power: 0.0625W; Tolerance: ±1%; Manufacturer Part Number: R0402_240R_1%_0.0625W_100PPM; Case: 0402; Mounted: Yes; Sense: No; Socket: No; SMD: Yes; Manufacturer1 Example: YAGEO PHYCOMP; Manufacturer1 ComponentHeight: 0.4mm; HelpURL: \\cern.ch\dfs\Applications\Altium\Datasheets\R0402_Phycomp_RC0402.pdf; Author: CERN DEM JLC; CreateDate: 03.12.2007; LatestRevisionDate: 17.10.2012
R77 = R0402_30K_1%_0.0625W_100PPM: Resistor - 1%; Part Description: General Purpose Thick Film Chip Resistor; Manufacturer: GENERIC; Manufacturer1 Part Number: 232270673003L; TC: ±100ppm/°C; PressFit: No; Part Number: R0402_30K_1%_0.0625W_100PPM; Component Kind: Standard; Component Type: Standard; Pin Count: 2; Value: 30k; Status: Not Recommended; Power: 0.0625W; Tolerance: ±1%; Manufacturer Part Number: R0402_30K_1%_0.0625W_100PPM; Case: 0402; Mounted: Yes; Sense: No; Socket: No; SMD: Yes; Manufacturer1 Example: YAGEO PHYCOMP; Manufacturer1 ComponentHeight: 0.4mm; HelpURL: \\cern.ch\dfs\Applications\Altium\Datasheets\R0402_Phycomp_RC0402.pdf; Author: CERN DEM JLC; CreateDate: 03.12.2007; LatestRevisionDate: 17.10.2012
R82 = R0402_1k_1%_0.0625W_100PPM: Resistor - 1%; Part Description: General Purpose Thick Film Chip Resistor; Manufacturer: GENERIC; Manufacturer1 Part Number: 232270671002L; TC: ±100ppm/°C; PressFit: No; Part Number: R0402_1K_1%_0.0625W_100PPM; Component Kind: Standard; Component Type: Standard; Pin Count: 2; Value: 1k; Status: Not Recommended; Power: 0.0625W; Tolerance: ±1%; Manufacturer Part Number: R0402_1K_1%_0.0625W_100PPM; Case: 0402; Mounted: Yes; Sense: No; Socket: No; SMD: Yes; Manufacturer1 Example: YAGEO PHYCOMP; Manufacturer1 ComponentHeight: 0.4mm; HelpURL: \\cern.ch\dfs\Applications\Altium\Datasheets\R0402_Phycomp_RC0402.pdf; Author: CERN DEM JLC; CreateDate: 03.12.2007; LatestRevisionDate: 17.10.2012
R84 = R0402_27K_1%_0.0625W_100PPM: Resistor - 1%; Part Description: General Purpose Thick Film Chip Resistor; Manufacturer: GENERIC; Manufacturer1 Part Number: 232270672703L; TC: ±100ppm/°C; PressFit: No; Part Number: R0402_27K_1%_0.0625W_100PPM; Component Kind: Standard; Component Type: Standard; Pin Count: 2; Value: 27k; Status: Not Recommended; Power: 0.0625W; Tolerance: ±1%; Manufacturer Part Number: R0402_27K_1%_0.0625W_100PPM; Case: 0402; Mounted: Yes; Sense: No; Socket: No; SMD: Yes; Manufacturer1 Example: YAGEO PHYCOMP; Manufacturer1 ComponentHeight: 0.4mm; HelpURL: \\cern.ch\dfs\Applications\Altium\Datasheets\R0402_Phycomp_RC0402.pdf; Author: CERN DEM JLC; CreateDate: 03.12.2007; LatestRevisionDate: 17.10.2012
R85 = 43k2 1% 0402: Resistor - 1%; Power: 0.063W; Value: 43k2; Tolerance: ±1%; Case: 0402
R93 = R0402_36K_1%_0.0625W_100PPM: Resistor - 1%; Part Description: General Purpose Thick Film Chip Resistor; Manufacturer: GENERIC; Manufacturer1 Part Number: 232270673603L; TC: ±100ppm/°C; PressFit: No; Part Number: R0402_36K_1%_0.0625W_100PPM; Component Kind: Standard; Component Type: Standard; Pin Count: 2; Value: 36k; Status: Not Recommended; Power: 0.0625W; Tolerance: ±1%; Manufacturer Part Number: R0402_36K_1%_0.0625W_100PPM; Case: 0402; Mounted: Yes; Sense: No; Socket: No; SMD: Yes; Manufacturer1 Example: YAGEO PHYCOMP; Manufacturer1 ComponentHeight: 0.4mm; HelpURL: \\cern.ch\dfs\Applications\Altium\Datasheets\R0402_Phycomp_RC0402.pdf; Author: CERN DEM JLC; CreateDate: 03.12.2007; LatestRevisionDate: 17.10.2012
T5 = FDS9926A: 20V DUAL N-Channel 2.5V Specified PowerTrench MOSFET; Part Description: 20V DUAL N-Channel 2.5V Specified PowerTrench® MOSFET; Manufacturer: FAIRCHILD SEMICONDUCTOR; PressFit: No; Bonding: No; Part Number: FDS9926A; Component Kind: Standard; Component Type: Standard; Device: FDS9926A; PackageDescription: SOIC 8, Pitch 1.27mm - Body 4x5mm, IPC Medium Density; Manufacturer Part Number: FDS9926A; Pin Count: 8; Case: SOIC8; Mounted: Yes; Socket: No; SMD: Yes; Sense: No; ComponentHeight: 1.75mm; HelpURL: \\cern.ch\dfs\Applications\Altium\Datasheets\FDS9926A.pdf; Author: CERN DEM BC; CreateDate: 2015-09-02; LatestRevisionDate: 2015-09-02
T6 = BSH103: N-CHANNEL MOSFET WITH DIODE; Part Description: 30V 850mA N-Channel Enhancement Mode Field-Effect Transistor; Manufacturer: NEXPERIA; PressFit: No; Bonding: No; Part Number: BSH103; Component Kind: Standard; Component Type: Standard; Device: BSH103; Footprint: SOT95P230X110-3N; PackageDescription: SOT23, 3 pin, Pitch 0.95mm - 1.3mm W X 2.9mm L X 1.1mm H, IPC Medium Density; Manufacturer Part Number: BSH103; Pin Count: 3; Case: SOT23-3; Mounted: Yes; Socket: No; SMD: Yes; Sense: No; ComponentHeight: 1.1mm; HelpURL: \\cern.ch\dfs\Applications\Altium\Datasheets\BSH103.pdf; Author: CERN DEM JLC; CreateDate: 16.03.2010; LatestRevisionDate: 20.06.2017
TP5-TP12 = SMD_PAD_1.27X1.27MM: Test Point; Part Description: 1.27mm x 1.27mm PCB Copper Area (SMD Test Point); Mounted: No; Part Number: SMD_PAD_1.27X1.27MM; Component Kind: Standard (No BOM); Component Type: Standard (No BOM); Pin Count: 1; Family: Test Point; Socket: No; SMD: Yes; Sense: No; Status: None; ComponentHeight: 0mm; HelpURL: Undefined; Author: CERN DEM JLC; CreateDate: 12.01.2008; LatestRevisionDate: 12.01.2008; PackageDescription: 1.27mm x 1.27mm PCB Copper Area (SMD Test Point)
U1 = CMP-0062-00810-3: 300mA Linear Voltage Regulator for Digital Applications, 4-pin Micro SMD, Pb-Free; Manufacturer: Texas Instruments; CompType: LDO IC; PackageTopMarking: X*I; High-Reliability: Y; PinCount: 4; PackageReference: YZR0004ABBA; Code_JEDEC: MO-211-BA; RoHS: Y; PartNumber: LP3991TL-1.2/NOPB; PackageDescription: Thin Micro SMD, 4 Bump (Large), 0.5mm Pitch; PowerWise: Y; ComponentLink1URL: http://www.ti.com/general/docs/lit/getliterature.tsp?genericPartNumber=LP3991&fileType=pdf; ComponentLink1Description: Datasheet URL